# Altium project LKS_SAOZHEN.PrjPcb
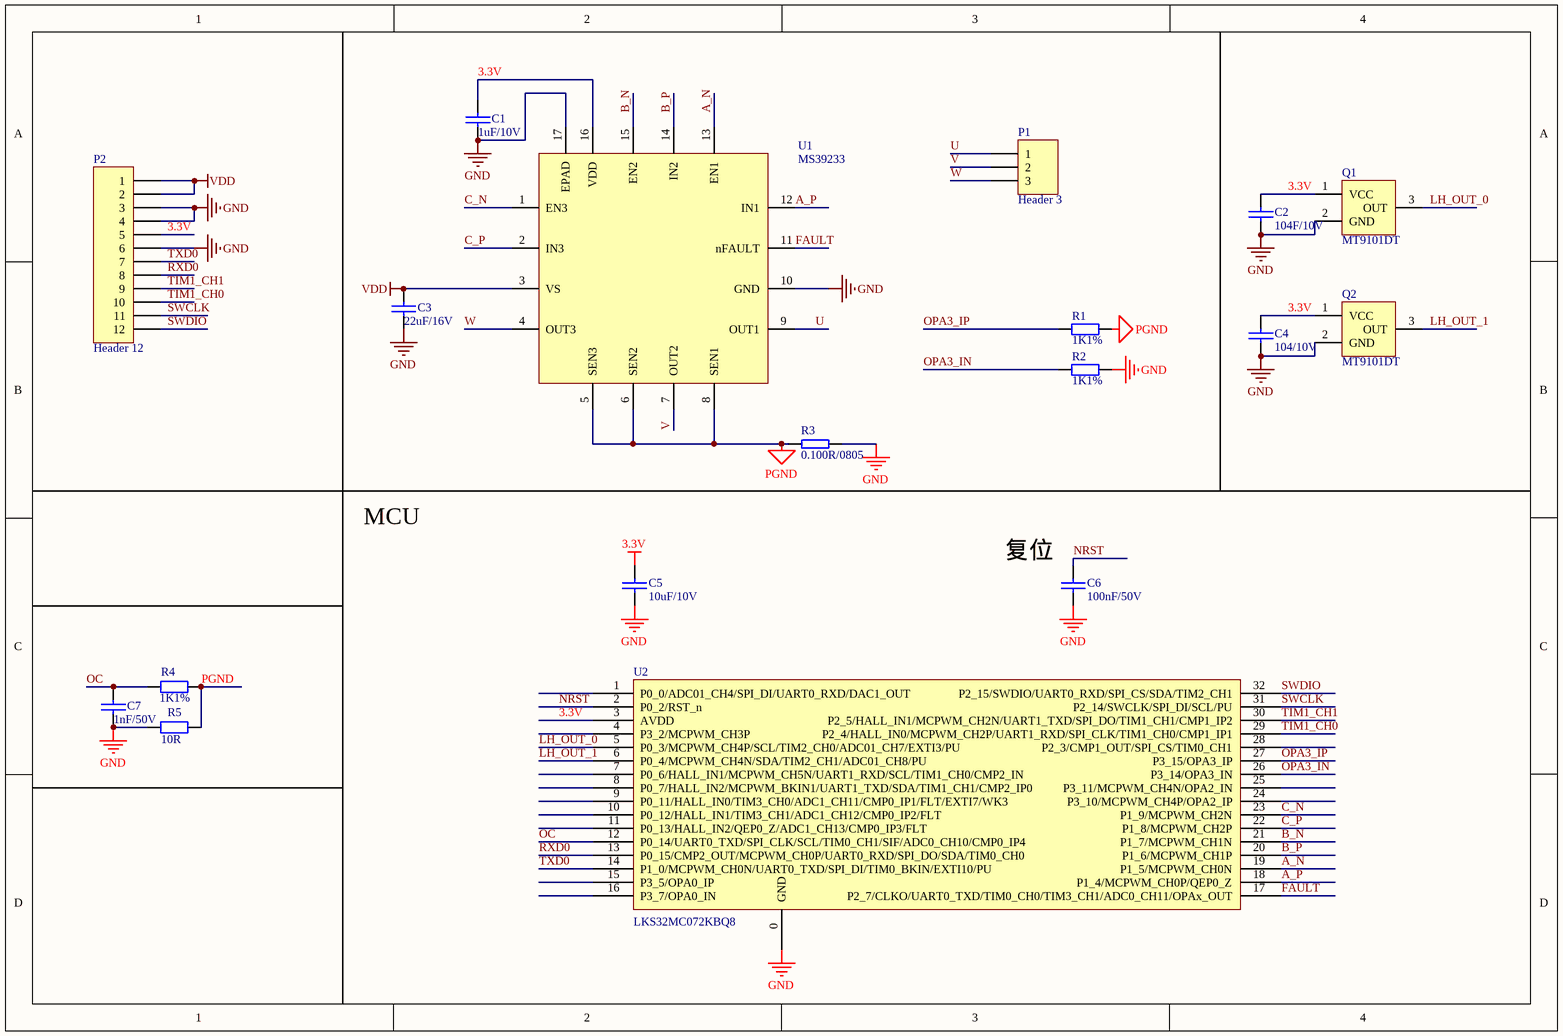
[diagram p0: LKS_EVB_MCU072_V1.0.SchDoc]
1 sheet, 18 parts. Net scope: global (net labels, ports and power ports of the same name join across sheets).
Board file: PCB1.PcbDoc

## Sheet LKS_EVB_MCU072_V1.0.SchDoc
size A4; SheetNumber: 1; SheetTotal: 1

### Parts
C1  1uF/10V  [C 0402_M]
C2  104F/10V  [C 0402_M]
C3  22uF/16V  [C 0805_M]
C4  104/10V  [C 0402_M]
C5  10uF/10V  [C 0402_M]
C6  100nF/50V  [C 0402_M]
C7  1nF/50V  [C 0402_M]
P1  Header 3  [HDR1X3]
P2  Header 12  [SMD-12]
Q1  MT9101DT  [DFN1616]
Q2  MT9101DT  [DFN1616]
R1  1K1%  [R 0402_M]
R2  1K1%  [R 0402_M]
R3  0.100R/0805  [R 0805_M]
R4  1K1%  [R 0402_M]
R5  10R  [R 0402_M]
U1  MS39233  [QFN16]
U2  LKS32MC072KBQ8  [QFN32 5x5_M]

### Nets
3.3V: C1.2 C2.2 C4.2 C5.2 P2.5 Q1.1(VCC) Q2.1(VCC) U1.16(VDD) U2.3(AVDD)
GND: C1.1 C2.1 C3.1 C4.1 C5.1 C6.2 C7.1 P2.3 P2.4 P2.6 Q1.2(GND) Q2.2(GND) R2.1 R3.2 R5.2 U1.10(GND) U1.17(EPAD) U2.0(GND)
PGND: R1.1 R3.1 R4.2 R5.1 U1.5(SEN3) U1.6(SEN2) U1.8(SEN1)
VDD: C3.2 P2.1 P2.2 U1.3(VS)
A_N: U1.13(EN1) U2.19(P1_5/MCPWM_CH0N)
A_P: U1.12(IN1) U2.18(P1_4/MCPWM_CH0P/QEP0_Z)
B_N: U1.15(EN2) U2.21(P1_7/MCPWM_CH1N)
B_P: U1.14(IN2) U2.20(P1_6/MCPWM_CH1P)
C_N: U1.1(EN3) U2.23(P1_9/MCPWM_CH2N)
C_P: U1.2(IN3) U2.22(P1_8/MCPWM_CH2P)
FAULT: U1.11(nFAULT) U2.17(P2_7/CLKO/UART0_TXD/TIM0_CH0/TIM3_CH1/ADC0_CH11/OPAx_OUT)
LH_OUT_0: Q1.3(OUT) U2.5(P0_3/MCPWM_CH4P/SCL/TIM2_CH0/ADC01_CH7/EXTI3/PU)
LH_OUT_1: Q2.3(OUT) U2.6(P0_4/MCPWM_CH4N/SDA/TIM2_CH1/ADC01_CH8/PU)
NRST: C6.1 U2.2(P0_2/RST_n)
OC: C7.2 R4.1 U2.12(P0_14/UART0_TXD/SPI_CLK/SCL/TIM0_CH1/SIF/ADC0_CH10/CMP0_IP4)
OPA3_IN: R2.2 U2.26(P3_14/OPA3_IN)
OPA3_IP: R1.2 U2.27(P3_15/OPA3_IP)
RXD0: P2.8 U2.13(P0_15/CMP2_OUT/MCPWM_CH0P/UART0_RXD/SPI_DO/SDA/TIM0_CH0)
SWCLK: P2.11 U2.31(P2_14/SWCLK/SPI_DI/SCL/PU)
SWDIO: P2.12 U2.32(P2_15/SWDIO/UART0_RXD/SPI_CS/SDA/TIM2_CH1)
TIM1_CH0: P2.10 U2.29(P2_4/HALL_IN0/MCPWM_CH2P/UART1_RXD/SPI_CLK/TIM1_CH0/CMP1_IP1)
TIM1_CH1: P2.9 U2.30(P2_5/HALL_IN1/MCPWM_CH2N/UART1_TXD/SPI_DO/TIM1_CH1/CMP1_IP2)
TXD0: P2.7 U2.14(P1_0/MCPWM_CH0N/UART0_TXD/SPI_DI/TIM0_BKIN/EXTI10/PU)
U: P1.1 U1.9(OUT1)
V: P1.2 U1.7(OUT2)
W: P1.3 U1.4(OUT3)

Not connected (* = marked no-connect by the designer): U2 1(P0_0/ADC01_CH4/SPI_DI/UART0_RXD/DAC1_OUT) 4(P3_2/MCPWM_CH3P) 7(P0_6/HALL_IN1/MCPWM_CH5N/UART1_RXD/SCL/TIM1_CH0/CMP2_IN) 8(P0_7/HALL_IN2/MCPWM_BKIN1/UART1_TXD/SDA/TIM1_CH1/CMP2_IP0) 9(P0_11/HALL_IN0/TIM3_CH0/ADC1_CH11/CMP0_IP1/FLT/EXTI7/WK3) 10(P0_12/HALL_IN1/TIM3_CH1/ADC1_CH12/CMP0_IP2/FLT) 11(P0_13/HALL_IN2/QEP0_Z/ADC1_CH13/CMP0_IP3/FLT) 15(P3_5/OPA0_IP) 16(P3_7/OPA0_IN) 24(P3_10/MCPWM_CH4P/OPA2_IP) 25(P3_11/MCPWM_CH4N/OPA2_IN) 28(P2_3/CMP1_OUT/SPI_CS/TIM0_CH1)

### Notes on the sheet
- MCU
- (near C6) 复位

### Library data of the parts
C1-C7 = C: Capacitor
P1 = Header 3: Header, 3-Pin; LatestRevisionDate: 17-Jul-2002; LatestRevisionNote: Re-released for DXP Platform.; Publisher: Altium Limited
P2 = Header 12: Header, 12-Pin; LatestRevisionDate: 17-Jul-2002; LatestRevisionNote: Re-released for DXP Platform.; Publisher: Altium Limited
R1 R2 R4 R5 = Res: Resistor; Value: K; Published: 8-Jun-2000; LatestRevisionDate: 17-Jul-2002; LatestRevisionNote: Re-released for DXP Platform.; PackageReference: AXIAL-0.4; Publisher: Altium Limited; PackageDescription: Axial Device, Thru-Hole; 2 Leads; 0.4 in Pin Spacing
R3 = RES2短
U2 = LKS32MC072KBQ82: LKS32MC072KBQ8 / 凌鸥创芯，128KFlash，12KRAM